# EAGLE schematic controllo motori - encoder_r2 (EAGLE 6.5.0)
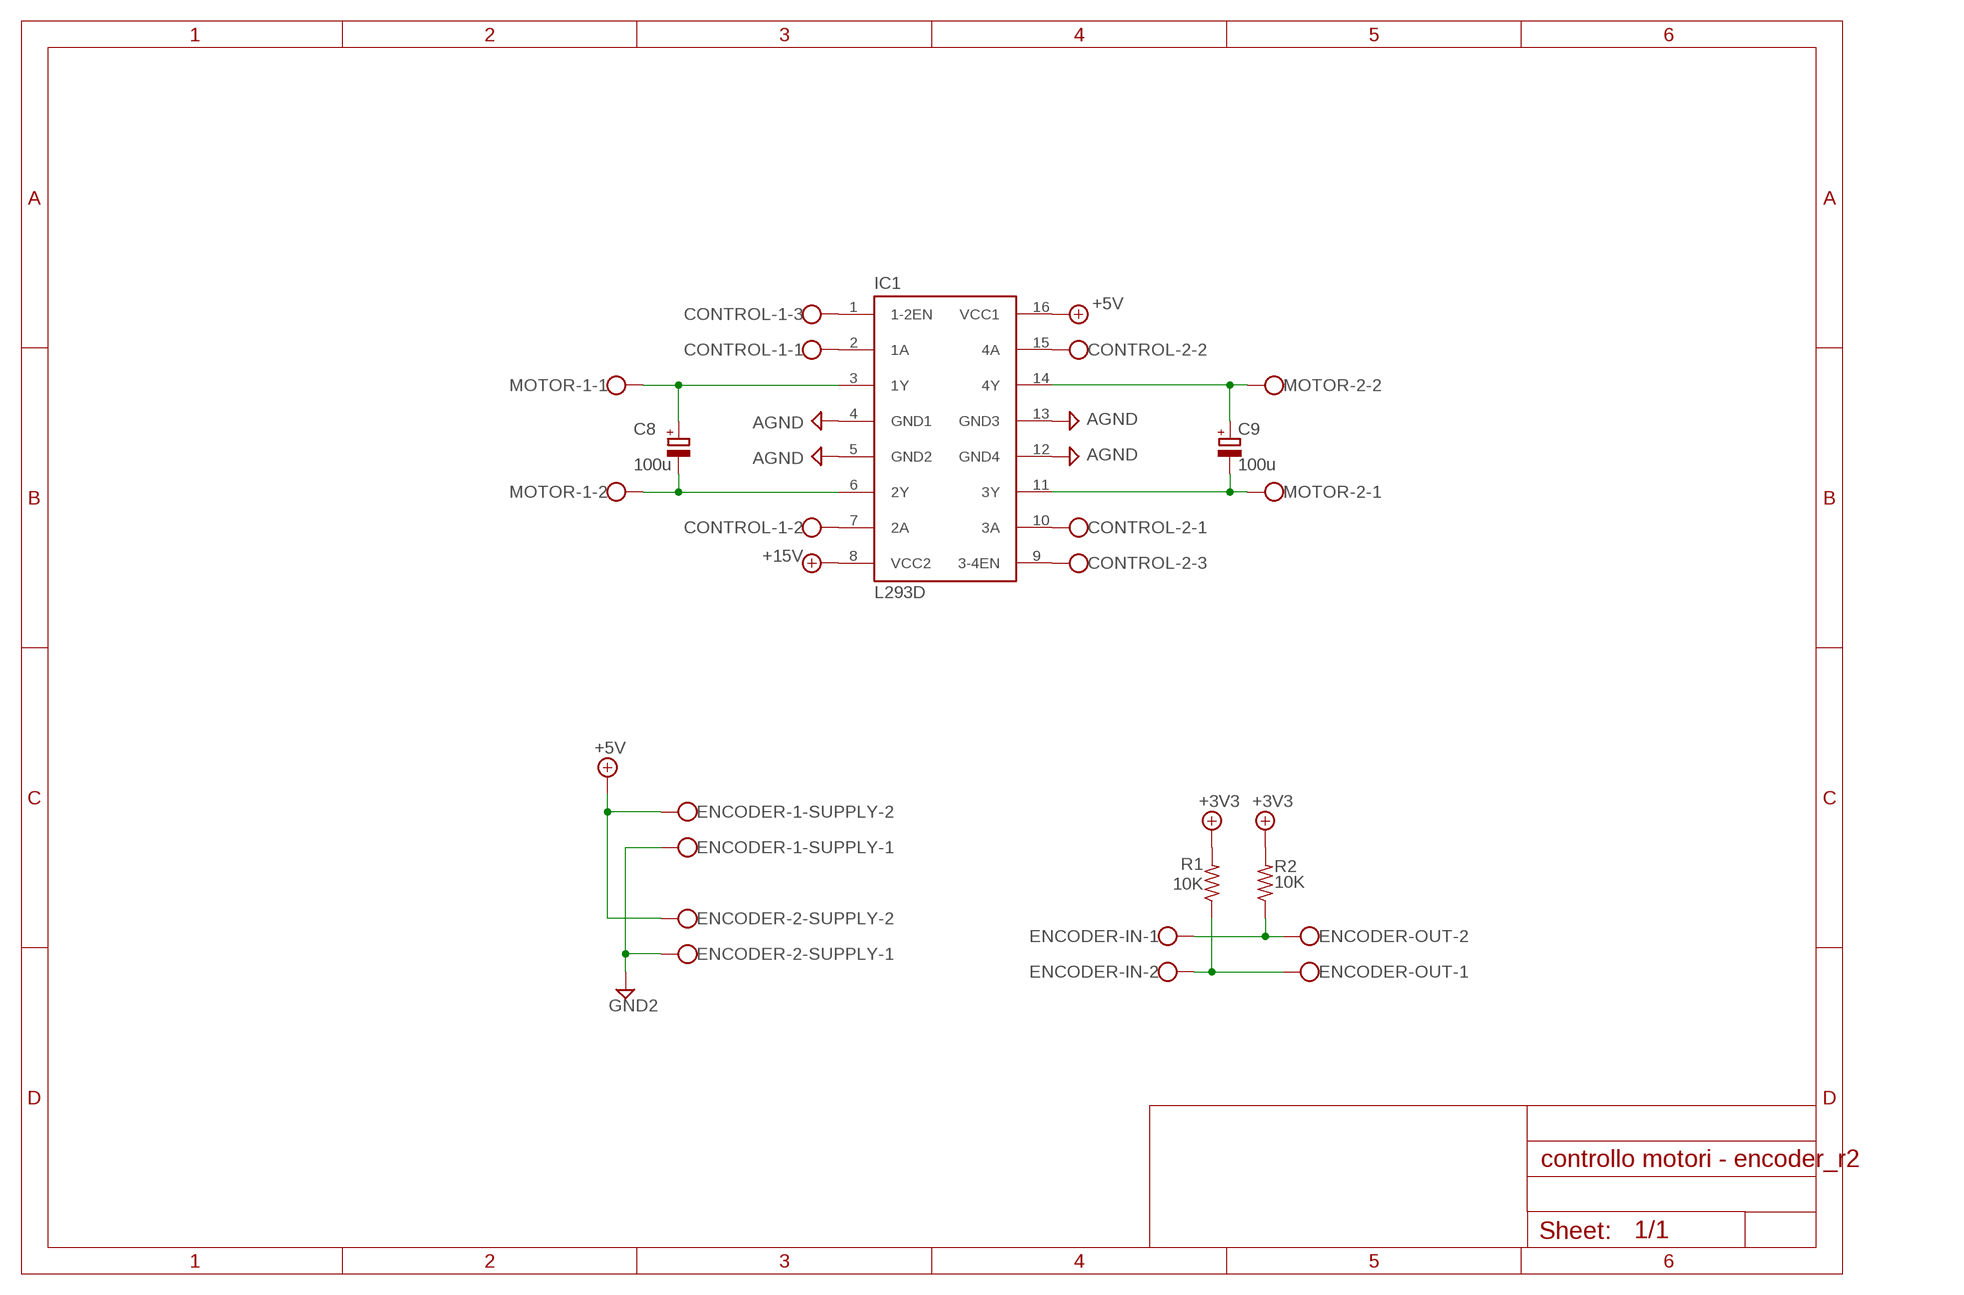
[diagram p0: schematic, sheet 1]

## Parts
C8  100u  CPOL-EUB45181B  [B45181B]
C9  100u  CPOL-EUB45181B  [B45181B]
CONTROL-1  W237-103  [W237-103]
CONTROL-2  W237-103  [W237-103]
ENCODER-1-SUPPLY  W237-102  [W237-102]
ENCODER-2-SUPPLY  W237-102  [W237-102]
ENCODER-IN  W237-102  [W237-102]
ENCODER-OUT  W237-102  [W237-102]
IC1  L293D  [DIL16]
MOTOR-1  W237-102  [W237-102]
MOTOR-2  W237-102  [W237-102]
R1  10K  R-US_0204/7  [0204/7]
R2  10K  R-US_0204/7  [0204/7]

## Nets
+4.1V: R1.2 R2.2 ; supply symbol labelled +3V3
+5V: ENCODER-1-SUPPLY.2 ENCODER-2-SUPPLY.2 IC1.16(VCC1)
+15V: IC1.8(VCC2)
AGND: IC1.4(GND1) IC1.5(GND2) IC1.12(GND4) IC1.13(GND3)
ANA-MUX-0: ENCODER-IN.1 ENCODER-OUT.2 R2.1
ANA-MUX-1: ENCODER-IN.2 ENCODER-OUT.1 R1.1
GND2: ENCODER-1-SUPPLY.1 ENCODER-2-SUPPLY.1
N$1: C8.+ IC1.3(1Y) MOTOR-1.1
N$2: C8.- IC1.6(2Y) MOTOR-1.2
N$3: C9.- IC1.11(3Y) MOTOR-2.1
N$4: C9.+ IC1.14(4Y) MOTOR-2.2
N$5: CONTROL-1.1 IC1.2(1A)
N$6: CONTROL-1.2 IC1.7(2A)
N$7: CONTROL-1.3 IC1.1(1-2EN)
N$8: CONTROL-2.3 IC1.9(3-4EN)
N$9: CONTROL-2.1 IC1.10(3A)
N$10: CONTROL-2.2 IC1.15(4A)

## Library data of the parts
C8 C9 = rcl:CPOL-EU: POLARIZED CAPACITOR, European symbol
CONTROL-1 CONTROL-2 = con-wago-500:W237-103: WAGO SCREW CLAMP; MPN: 237-103; OC_FARNELL: unknown; OC_NEWARK: 18M7116
ENCODER-1-SUPPLY ENCODER-2-SUPPLY ENCODER-IN ENCODER-OUT MOTOR-1 MOTOR-2 = con-wago-500:W237-102: WAGO SCREW CLAMP; MPN: 237-102; OC_FARNELL: unknown; OC_NEWARK: 70K9898
IC1 = st-microelectronics:L293D: PUSH-PULL 4 CHANNEL DRIVER; MPN: L293D; OC_FARNELL: 9589619; OC_NEWARK: 56P8249
R1 R2 = rcl:R-US_: RESISTOR, American symbol